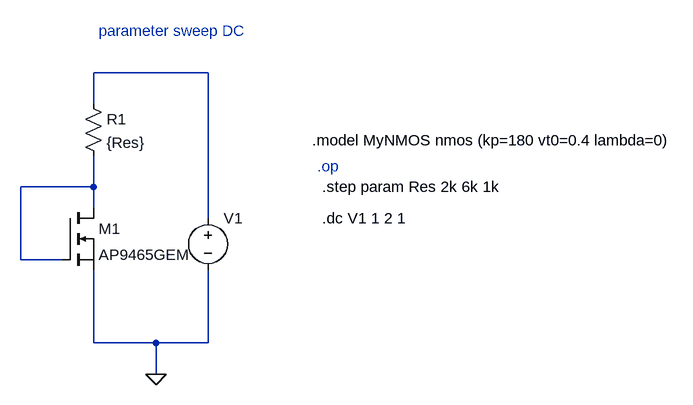
[diagram p0: schematic Paramsweep_MOSFET.asc]
Paramsweep_MOSFET.asc, the LTspice schematic file:
Version 4.1
SHEET 1 1052 680
WIRE 288 96 112 96
WIRE 112 144 112 96
WIRE 112 272 112 224
WIRE 112 272 0 272
WIRE 112 304 112 272
WIRE 288 320 288 96
WIRE 0 384 0 272
WIRE 64 384 0 384
WIRE 112 512 112 400
WIRE 208 512 112 512
WIRE 288 512 288 400
WIRE 288 512 208 512
WIRE 208 560 208 512
FLAG 208 560 0
SYMBOL nmos 64 304 R0
SYMATTR InstName M1
SYMATTR Value AP9465GEM
SYMBOL voltage 288 304 R0
WINDOW 123 0 0 Left 0
WINDOW 39 0 0 Left 0
SYMATTR InstName V1
SYMATTR Value ""
SYMBOL res 96 128 R0
SYMATTR InstName R1
SYMATTR Value {Res}
TEXT 120 32 Left 2 ;parameter sweep DC
TEXT 448 200 Left 2 !.model MyNMOS nmos (kp=180 vt0=0.4 lambda=0)
TEXT 456 240 Left 2 ;.op
TEXT 464 272 Left 2 !.step param Res 2k 6k 1k
TEXT 464 320 Left 2 !.dc V1 1 2 1

The netlist it stands for:
* Paramsweep_MOSFET.asc
M1 N002 N002 0 0 AP9465GEM
V1 N001 0
R1 N001 N002 {Res}
.model NMOS NMOS
.model PMOS PMOS
.lib standard.mos
* parameter sweep DC
.model MyNMOS nmos (kp=180 vt0=0.4 lambda=0)
* .op
.step param Res 2k 6k 1k
.dc V1 1 2 1
.backanno
.end